# EAGLE design RP2040-M2-B-M-key (EAGLE 9.6.2)
Assembly variants: Lite
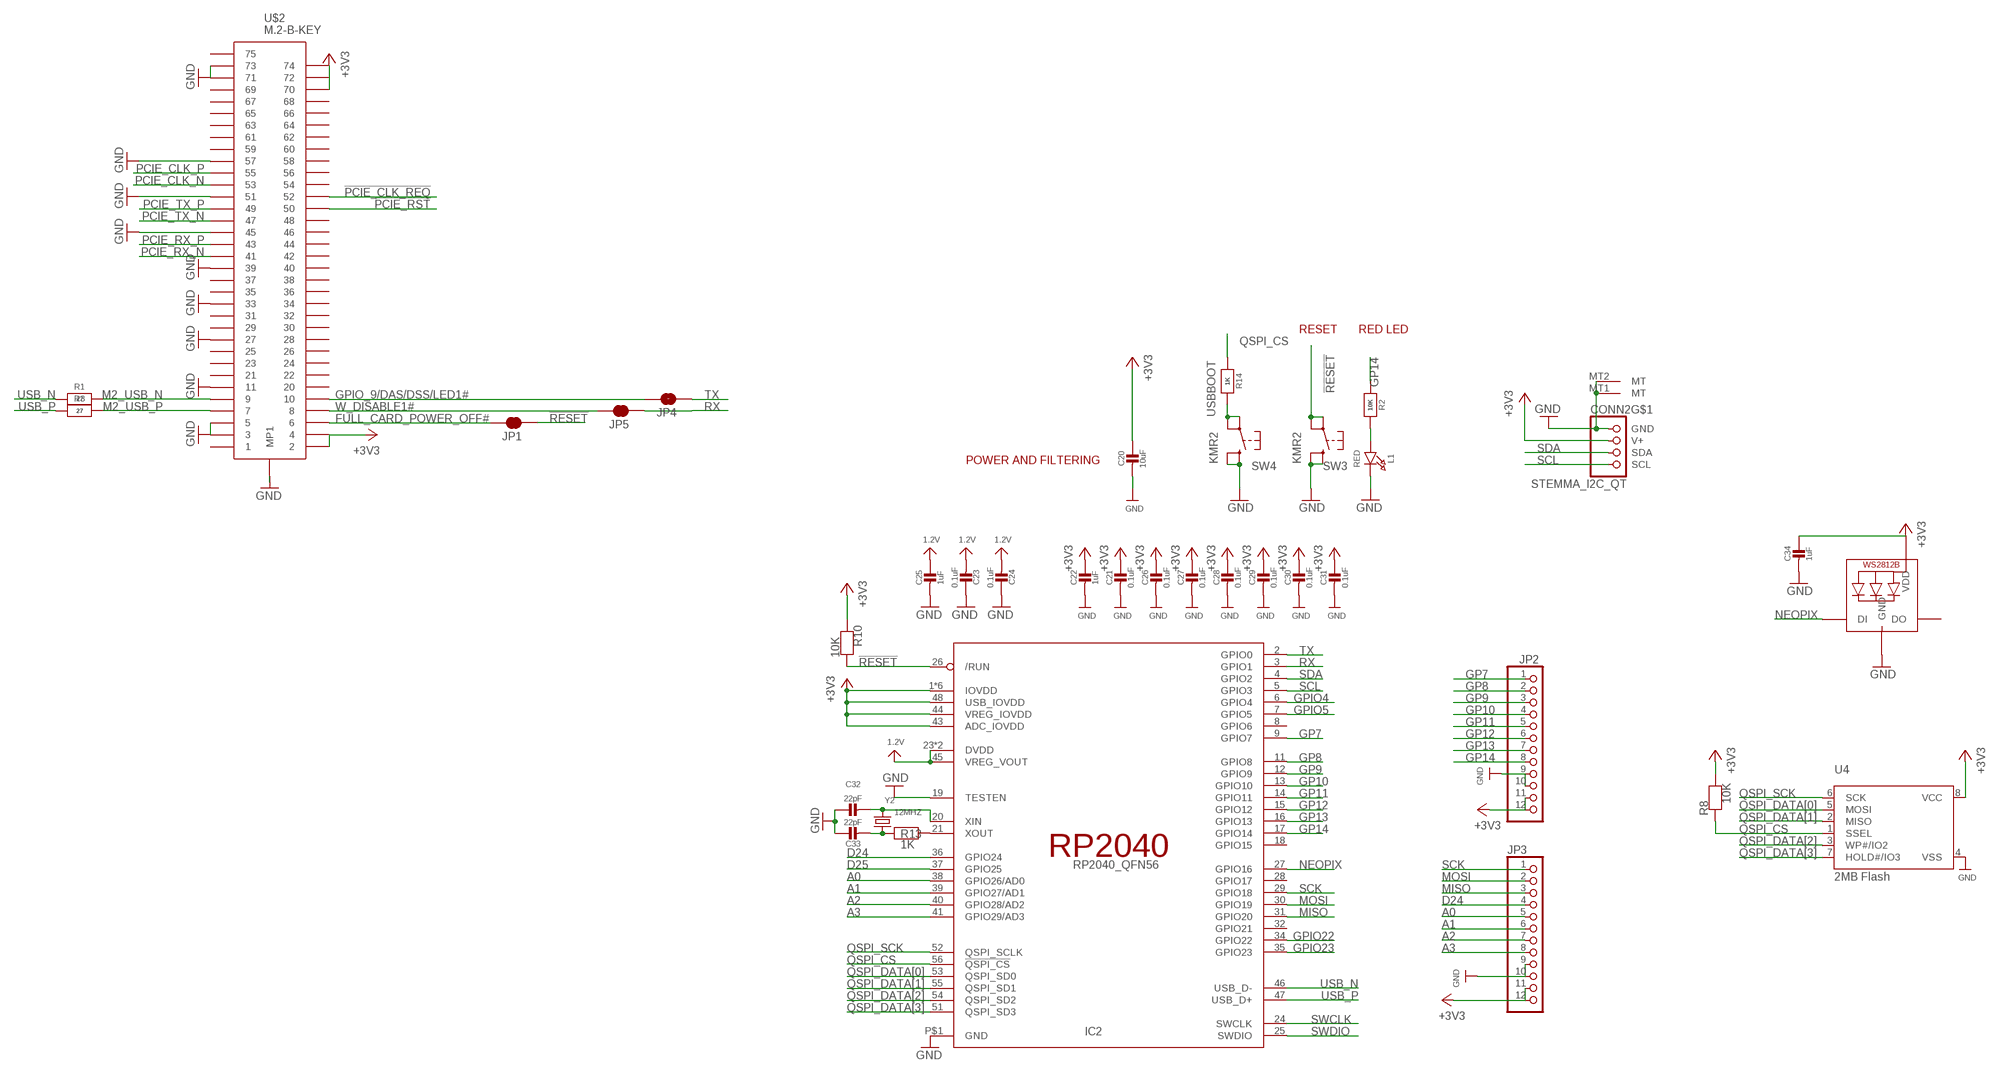
[diagram p0: schematic, sheet 1]

## Parts
C20  10uF  CAP_CERAMIC0805-NOOUTLINE  [0805-NO]
C21  0.1uF  CAP_CERAMIC_0402MP  [_0402MP]
C22  1uF  CAP_CERAMIC_0402MP  [_0402MP]
C23  0.1uF  CAP_CERAMIC_0402MP  [_0402MP]
C24  0.1uF  CAP_CERAMIC_0402MP  [_0402MP]
C25  1uF  CAP_CERAMIC_0402MP  [_0402MP]
C26  0.1uF  CAP_CERAMIC_0402MP  [_0402MP]
C27  0.1uF  CAP_CERAMIC_0402MP  [_0402MP]
C28  0.1uF  CAP_CERAMIC_0402MP  [_0402MP]
C29  0.1uF  CAP_CERAMIC_0402MP  [_0402MP]
C30  0.1uF  CAP_CERAMIC_0402MP  [_0402MP]
C31  0.1uF  CAP_CERAMIC_0402MP  [_0402MP]
C32  22pF  CAP_CERAMIC_0402MP  [_0402MP]
C33  22pF  CAP_CERAMIC_0402MP  [_0402MP]
C34  1uF  CAP_CERAMIC_0402MP  [_0402MP]
CONN2  STEMMA_I2C_QT  [JST_SH4]
IC2  RP2040_QFN56  [QFN56_7MM_REDUCEDEPAD]
JP1  JUMPER-SMT_2_NC_TRACE_NO-SILK  [SMT-JUMPER_2_NC_TRACE_NO-SILK]
JP2  HEADER-1X12  [1X12_ROUND]
JP3  HEADER-1X12  [1X12_ROUND]
JP4  JUMPER-SMT_2_NC_TRACE_NO-SILK  [SMT-JUMPER_2_NC_TRACE_NO-SILK]
JP5  JUMPER-SMT_2_NC_TRACE_NO-SILK  [SMT-JUMPER_2_NC_TRACE_NO-SILK]
L1  RED  LED0603_NOOUTLINE  [CHIPLED_0603_NOOUTLINE]
LED2  WS2812B3535  [LED3535]
R1  27  RESISTOR_0402MP  [_0402MP]
R2  10K  RESISTOR_0402MP  [_0402MP]
R3  27  RESISTOR_0402MP  [_0402MP]
R8  10K  RESISTOR_0402MP  [_0402MP]
R10  10K  RESISTOR_0402MP  [_0402MP]
R13  1K  RESISTOR_0402MP  [_0402MP]
R14  1K  RESISTOR_0402MP  [_0402MP]
SW3  KMR2  SWITCH_TACT_SMT4.6X2.8  [BTN_KMR2_4.6X2.8]
SW4  KMR2  SWITCH_TACT_SMT4.6X2.8  [BTN_KMR2_4.6X2.8]
U4  2MB Flash  SPIFLASH_8PIN208MIL  [SOIC8_208MIL]
U$2  M.2-B-KEY  [M.2-B-KEY]
Y2  12MHZ  CRYSTALTHIN  [CRYSTAL_3.2X2.5]

## Nets
1.2V: C23.2 C24.2 C25.1 IC2.23(DVDD) IC2.45(VREG_VOUT) IC2.50(DVDD)
!PCIE_CLK_REQ: U$2.P$52
!PCIE_RST: U$2.P$50
!RESET: IC2.26(/RUN) JP1.2 R10.2 SW3.A'(P1) SW3.A(P)
+3V3: C20.1 C21.1 C22.1 C26.1 C27.1 C28.1 C29.1 C30.1 C31.1 C34.1 CONN2.2(V+) IC2.1(IOVDD) IC2.10(IOVDD) IC2.22(IOVDD) IC2.33(IOVDD) IC2.42(IOVDD) IC2.43(ADC_IOVDD) IC2.44(VREG_IOVDD) IC2.48(USB_IOVDD) IC2.49(IOVDD) JP2.11 JP2.12 JP3.11 JP3.12 LED2.2(VDD) R8.2 R10.1 U4.8(VCC) U$2.P$2 U$2.P$4 U$2.P$70 U$2.P$72 U$2.P$74
A0: IC2.38(GPIO26/AD0) JP3.5
A1: IC2.39(GPIO27/AD1) JP3.6
A2: IC2.40(GPIO28/AD2) JP3.7
A3: IC2.41(GPIO29/AD3) JP3.8
D24: IC2.36(GPIO24) JP3.4
D25: IC2.37(GPIO25)
FULL_CARD_POWER_OFF#: JP1.1 U$2.P$6
GND: C20.2 C21.2 C22.2 C23.1 C24.1 C25.2 C26.2 C27.2 C28.2 C29.2 C30.2 C31.2 C32.1 C33.1 C34.2 CONN2.1(GND) CONN2.MT1(MT) CONN2.MT2(MT) IC2.19(TESTEN) IC2.P$1(GND) JP2.9 JP2.10 JP3.9 JP3.10 L1.C LED2.4(GND) SW3.B'(S1) SW3.B(S) SW4.B'(S1) SW4.B(S) U4.4(VSS) U$2.MOUNTING-HOLE(MP1) U$2.P$3 U$2.P$5 U$2.P$11 U$2.P$27 U$2.P$33 U$2.P$39 U$2.P$45 U$2.P$51 U$2.P$57 U$2.P$71 U$2.P$73
GP7: IC2.9(GPIO7) JP2.1
GP8: IC2.11(GPIO8) JP2.2
GP9: IC2.12(GPIO9) JP2.3
GP10: IC2.13(GPIO10) JP2.4
GP11: IC2.14(GPIO11) JP2.5
GP12: IC2.15(GPIO12) JP2.6
GP13: IC2.16(GPIO13) JP2.7
GP14: IC2.17(GPIO14) JP2.8 R2.1
GPIO4: IC2.6(GPIO4)
GPIO5: IC2.7(GPIO5)
GPIO22: IC2.34(GPIO22)
GPIO23: IC2.35(GPIO23)
GPIO_9/DAS/DSS/LED1#: JP4.1 U$2.P$10
M2_USB_N: R1.2 U$2.P$9
M2_USB_P: R3.2 U$2.P$7
MISO: IC2.31(GPIO20) JP3.3
MOSI: IC2.30(GPIO19) JP3.2
N$1: L1.A R2.2
N$2: IC2.21(XOUT) R13.2
N$3: C32.2 IC2.20(XIN) Y2.2
N$4: C33.2 R13.1 Y2.1
NEOPIX: IC2.27(GPIO16) LED2.1(DI)
PCIE_CLK_N: U$2.P$53
PCIE_CLK_P: U$2.P$55
PCIE_RX_N: U$2.P$41
PCIE_RX_P: U$2.P$43
PCIE_TX_N: U$2.P$47
PCIE_TX_P: U$2.P$49
QSPI_CS: IC2.56(!QSPI_CS) R8.1 R14.1 U4.1(SSEL)
QSPI_DATA[0]: IC2.53(QSPI_SD0) U4.5(MOSI)
QSPI_DATA[1]: IC2.55(QSPI_SD1) U4.2(MISO)
QSPI_DATA[2]: IC2.54(QSPI_SD2) U4.3(WP#/IO2)
QSPI_DATA[3]: IC2.51(QSPI_SD3) U4.7(HOLD#/IO3)
QSPI_SCK: IC2.52(QSPI_SCLK) U4.6(SCK)
RX: IC2.3(GPIO1) JP5.2
SCK: IC2.29(GPIO18) JP3.1
SCL: CONN2.4(SCL) IC2.5(GPIO3)
SDA: CONN2.3(SDA) IC2.4(GPIO2)
SWCLK: IC2.24(SWCLK)
SWDIO: IC2.25(SWDIO)
TX: IC2.2(GPIO0) JP4.2
USB_N: IC2.46(USB_D-) R1.1
USB_P: IC2.47(USB_D+) R3.1
USBBOOT: R14.2 SW4.A'(P1) SW4.A(P)
W_DISABLE1#: JP5.1 U$2.P$8
Unconnected: IC2.8(GPIO6) IC2.18(GPIO15) IC2.28(GPIO17) IC2.32(GPIO21) LED2.3(DO) U$2.P$1 U$2.P$20 U$2.P$21 U$2.P$22 U$2.P$23 U$2.P$24 U$2.P$25 U$2.P$26 U$2.P$28 U$2.P$29 U$2.P$30 U$2.P$31 U$2.P$32 U$2.P$34 U$2.P$35 U$2.P$36 U$2.P$37 U$2.P$38 U$2.P$40 U$2.P$42 U$2.P$44 U$2.P$46 U$2.P$48 U$2.P$54 U$2.P$56 U$2.P$58 U$2.P$59 U$2.P$60 U$2.P$61 U$2.P$62 U$2.P$63 U$2.P$64 U$2.P$65 U$2.P$66 U$2.P$67 U$2.P$68 U$2.P$69 U$2.P$75

## Notes on the sheet
- RESET | RED LED
- POWER AND FILTERING

## Library data of the parts
C20-C34 = microbuilder:CAP_CERAMIC: Ceramic Capacitors
CONN2 = microbuilder:STEMMA_I2C
IC2 = Custom-Parts:RP2040
JP1 JP4 JP5 = SparkFun-Jumpers:JUMPER-SMT_2_NC_TRACE: Normally closed trace jumper This jumper has a trace between two pads so it's normally closed (NC). Use a razor knife to open the connection. For best results follow the IPC guidelines for cutting traces: Cutout at least 0.063 mm (0.005 in). Remove all loose material to clean up the cut area. Seal the cut with an approved epoxy. Reapply solder to reclose the connection.
JP2 JP3 = microbuilder:HEADER-1X12
L1 = microbuilder:LED: LED 0603 - 0603 Surface Mount Package 2mA: Green LED - Low Power (3.9mcd, 2ma, 1.7Vf) - Digikey: 475-2709-2-ND Orange LED - Low Power (9.8mcd, 2ma, 1.8Vf) - Digikey: 475-1194-2-ND Red LED - Low Power (5mcd, 2ma, 1.8Vf) - Digikey: 475-1195-2-ND Yellow LED - Low Power (7mcd, 2ma, 1.8Vf) - Digikey: 475-1196-2-ND 5mA: Blue LED - Low Power (17mcd, 5ma, 2.9Vf) - Digikey: LNJ937W8CRACT-ND 0805 - 0805 Surface Mount Package 2mA: Red LED (8.8mcd, 2mA, 1.8Vf, Clear) - Low Power [Digikey: 475-2510-1-ND] Green LED (5mcd, 2mA, 1.8Vf, Clear) - Low Power [Digikey: 475-2730-1-ND] Yellow LED (11.3mcd, 2mA, 1.8Vf, Clear) - Low Power [Digikey: 475-2555-1-ND] 20mA: Red LED (104mcd, 20mA, Diffused) - LS R976 [Digikey: 475-1278-6-ND] Red LED (12mcd, 20mA, 2.0Vf, Clear) - APT2012EC [Digikey: 754-1128-1-ND] Green LED (15mcd, 20mA, 2.2Vf, Clear) - APT2012GC [Digikey: 754-1131-1-ND] Orange LED (160mcd, 20mA, 2.1Vf, Clear) - APT2012SECK [Digikey: 754-1130-1-ND] 1206 - 1206 Surface Mount Package Green LED (26mcd, 20mA, Diffused) - LG N971 [Digikey: 475-1407-6-ND] Red LED (15mcd, 20mA, Diffused) - LH N974 [Digikey: 475-1416-6-ND] Cree - Cree High-Power Surface Mount LEDs XPEBWT-L1-0000-00D50 - White 111lm 350mA 2.9Vf 6200K 110° XTEAWT-00-0000-00000LEE3 - White 114lm 350mA 2.85Vf 5000K 115° Everlight - Everlight 45-21 Series Surface Mount LEDs 45-21/QK2C-B2832AC2CB2/2T - Warm White 2000mcd 20mA 3.25Vf 3050K 120° 45-21/LK2C-B38452C4CB2/2T - Nuetral White 2000mcd 20mA 3.25Vf 4150K 120° 45-21/LK2C-B50634C6CB2/2T - Cold White 2200mcd 20mA 3.25Vf 5650K 120° PLCC2 Reverse Mount LS T77K-J1L2-1-0-2-R18-Z - Red 11.25mcd 2mA 1.8Vf 630nm 120° LO T77K-L1M2-24-Z - Orange 19.6mcd 2mA 1.8Vf 606nm 120° LY T77K-K2M1-26-Z - Yellow 15.7mcd 2mA 1.8Vf 587nm 120°
LED2 = adafruit:WS2812B
R1-R3 R8 R10 R13 R14 = microbuilder:RESISTOR: Resistors 0402 - 0402 Surface Mount Package 22 Ohm 1% 1/16W [Digikey: 311-22.0LRTR-ND] 33 Ohm 5% 1/16W 1.0K 5% 1/16W 1.5K 5% 1/16W 2.0K 1% 1/16W 10.0K 1% 1/16W [Digikey: 311-10.0KLRTR-ND] 10.0K 5% 1/16W [Digikey: RMCF0402JT10K0TR-ND] 12.1K 1% 1/16W [Digikey: 311-22.0LRTR-ND] 100.0K 5% 1/16W 0603 - 0603 Surface Mount Package 0 Ohm 1/10 Watt 1% Resistor 15 Ohm 1/10 Watt 1% Resistor 33 Ohm 1/10 Watt 1% Resistor 49.9 Ohm 1/10 Watt 1% Resistor 100 Ohm 1/10 Watt 1% Resistor 150 Ohm 1/10 Watt 1% Resistor 240 Ohm 1/10 Watt 1% Resistor 390 Ohm 1/10 Watt 1% Resistor 560 Ohm 1/10 Watt 1% Resistor 680 Ohm 1/10 Watt 1% Resistor 750 Ohm 1/10 Watt 1% Resistor 1.0K Ohm 1/10 Watt 1% Resistor 1.5K Ohm 1/10 Watt 1% Resistor 2.0K Ohm 1/10 Watt 1% Resistor 2.2K Ohm 1/10 Watt 1% Resistor 3.3K Ohm 1/10 Watt 1% Resistor 4.7K Ohm 1/10 Watt 1% Resistor 10.0K Ohm 1/10 Watt 1% Resistor 12.0K Ohm 1/10 Watt 1% Resistor 12.1K Ohm 1/10 Watt 1% Resistor 20.0K Ohm 1/10 Watt 1% Resistor 33.0K Ohm 1/10 Watt 1% Resistor 100.0K Ohm 1/10 Watt 1% Resistor 0805 - 0805 Surface Mount Package 0 Ohm 1/8 Watt 1% Resistor 33 Ohm 1/8 Watt 1% Resistor 100 Ohm 1/8 Watt 1% Resistor 150 Ohm 1/8 Watt 1% Resistor 200 Ohm 1/8 Watt 1% Resistor 240 Ohm 1/8 Watt 1% Resistor 330 Ohm 1/8 Watt 1% Resistor 390 Ohm 1/8 Watt 1% Resistor 470 Ohm 1/8 Watt 1% Resistor 1.0K Ohm 1/8 Watt 1% Resistor 1.5K Ohm 1/8 Watt 1% Resistor 2.0K Ohm 1/8 Watt 1% Resistor 4.7K Ohm 1/8 Watt 1% Resistor 5.1K Ohm 1/8 Watt 1% Resistor 5.6K Ohm 1/8 Watt 1% Resistor 10.0K Ohm 1/8 Watt 1% Resistor 22.0K Ohm 1/8 Watt 1% Resistor 33.0K Ohm 1/8 Watt 1% Resistor 100K Ohm 1/8 Watt 1% Resistor 1206 - 1206 Surface Mount Package 2012 - 2010 Surface Mount Package 0.11 Ohm 1/2 Watt 1% Resistor - Digikey: RHM.11UCT-ND
SW3 SW4 = microbuilder:SWITCH_TACT_SMT: SMT Tact Switches 6x6mm - Digikey: P12940SCT-ND KMR2 (4.6x2.8mm) - Digikey: 401-1426-1-ND EVQ-PQHB55 - Light Touch, 160GF (4.5x4.5mm) - Digikey: P8090SCT-ND KMT0 - KMT021 NGJ LHS (etc.) IP68/Waterproof - Digikey: CKN10289CT-ND
U4 = microbuilder:SPIFLASH_8PIN: SOIC8 SPI Flash Be careful with the size since SOIC8 flash comes in several 'widths' SOIC8 150 mil M25P16 - 16Mbit (2Mbit x 8) Serial Flash (75MHz SPI Bus), Supply: 2.7-3.6V Digikey: SOIC8 - M25P16-VMN6P-ND SOIC8 208 mil W25Q16BVSSIG - 16Mbit (2Mbit x 8) Serial Flash (104MHz SPI Bus), Supply: 2.7-3.6V Digikey: SOIC8 - W25Q16BVSSIG-ND
U$2 = Custom-Parts:M.2-B-KEY
Y2 = microbuilder:CRYSTAL: Crystals HC49UP - Surface Mount Crystal 4.0MHz 18pF +/-30ppm Surface Mount Crystal [Digikey: 535-9857-1-ND] 12.0 MHz Surface Mount Crystal [Digikey: 535-9869-6-ND] 25.0 MHz Surface Mount Crystal [Digikey: 535-9078-1-ND] 2.5 x 2.0mm - MEMs SMT Crystal 16.0 MHz 10pF 20ppm 2.5 x 2.0mm Crystal [Digikey -40-85°C: 535-10923-1-ND] 3.2 x 2.5mm - MEMs SMT Crystal 12.0 MHz 8pF 15ppm 3.2 x 2.5mm Crystal [Digikey: -10-70°C: 644-1047-1-ND -40-125°C: 644-1128-1-ND] 16.0 MHz 8pF 15ppm 3.2 x 2.5mm Crystal [Digikey: -10-70°C: 644-1049-1-ND -40-125°C: 644-1129-2-ND] 16.0 MHz 10pF 10ppm 3.2 x 2.5mm Crystal [Digikey: 644-1100-1-ND] 27.12 MHz 18pF 30ppm 3.2 x 2.5mm Crystal [Digikey: 887-1424-1-ND] 27.12MHz 10pF 10ppm 3.2 x 2.5mm Crystal [Digikey: 887-1329-1-ND] 4.9 x 1.8mm - MEMs SMT Crystal 32.768 KHz 12.5pF 20ppm 4.9 x 1.8mm Crystal [Digikey: SE2415CT-ND] 8.0 x 3.8mm - Surface Mount Crystal 32.768kHz 12.5pF 20ppm -40°C-85°C [Digikey: 535-9166-2-ND] Cylinder 32.768KHz Cylinder Crystal (2x6mm body) [Ex. Digikey: 300-8341-2-ND]

## Board
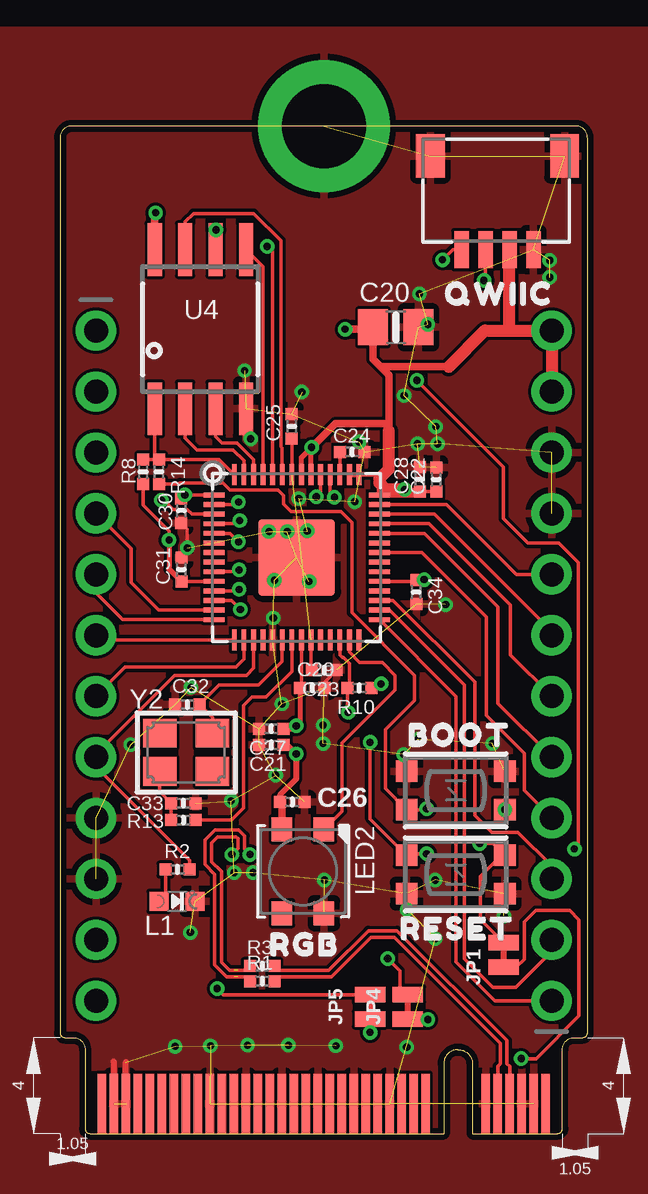
[diagram p1: board, top side]
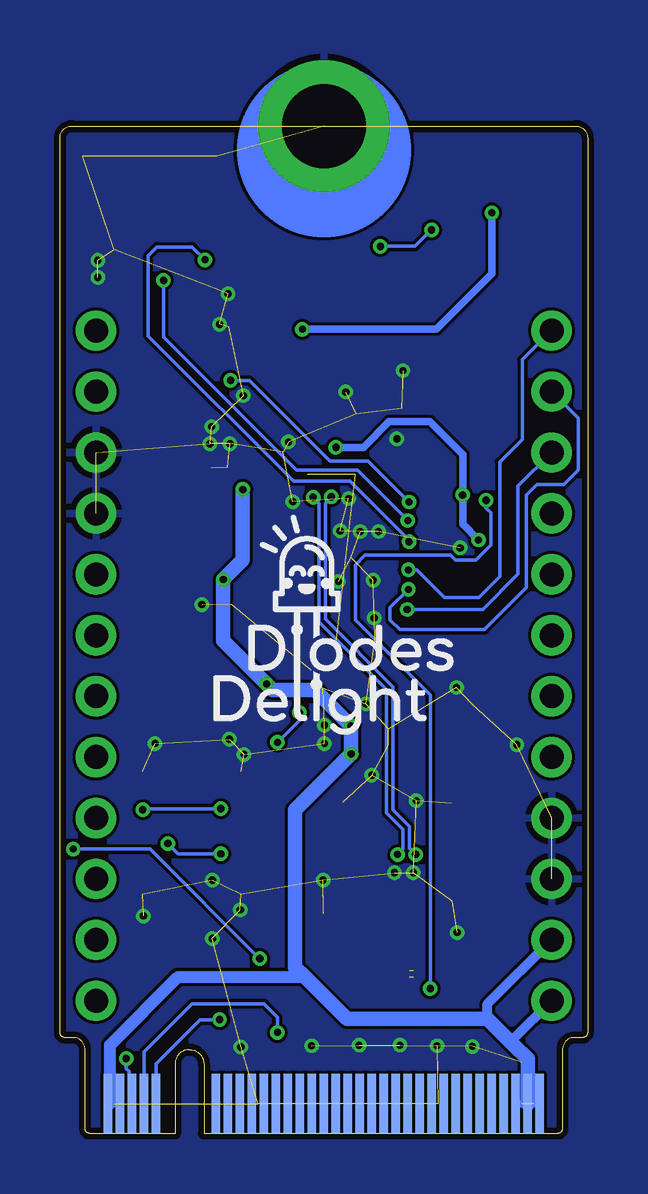
[diagram p2: board, bottom side, seen from below]

Size 22 x 42 mm. Coordinates in mm from the lower left corner, seen from the top.
Copper layers (1*16): Top 0.035mm / dielectric 0.8mm / Bottom 0.035mm
Design rules "jlc-2layer": minimum track width 6mil, minimum drill 0.3mm, track to track 5mil, track to pad 5mil, pad to pad 5mil, via to via 5mil, smd to smd 0mil, copper to edge 0.25mm, drill to drill 10mil, minimum pad ring 10mil, minimum via ring 0.15mm, stop-mask expansion 2mil, vias tented up to drill 100mil, thermal gap 10mil

### Footprints (pad centres in the part's own frame; a part is rotated, then mirrored left to right if it is on the bottom)
0805-NO = smd 1.24 x 1.5: 1 -0.95,0; 2 0.95,0
_0402MP = smd 0.5 x 0.5: 1 -0.508,0; 2 0.508,0
JST_SH4 = smd 0.6 x 1.55: 1 -1.5,2.514; 2 -0.5,2.514; 3 0.5,2.514; 4 1.5,2.514 | smd 1.2 x 1.8: MT1 -2.8,-1.386; MT2 2.8,-1.386
QFN56_7MM_REDUCEDEPAD = smd 0.875 x 0.2: 1 -3.45,2.6; 2 -3.45,2.2; 3 -3.45,1.8; 4 -3.45,1.4; 5 -3.45,1; 6 -3.45,0.6; 7 -3.45,0.2; 8 -3.45,-0.2; 9 -3.45,-0.6; 10 -3.45,-1; 11 -3.45,-1.4; 12 -3.45,-1.8; 13 -3.45,-2.2; 14 -3.45,-2.6; 29 3.45,-2.6; 30 3.45,-2.2; 31 3.45,-1.8; 32 3.45,-1.4; 33 3.45,-1; 34 3.45,-0.6; 35 3.45,-0.2; 36 3.45,0.2; 37 3.45,0.6; 38 3.45,1; 39 3.45,1.4; 40 3.45,1.8; 41 3.45,2.2; 42 3.45,2.6 | smd 0.2 x 0.875: 15 -2.6,-3.45; 16 -2.2,-3.45; 17 -1.8,-3.45; 18 -1.4,-3.45; 19 -1,-3.45; 20 -0.6,-3.45; 21 -0.2,-3.45; 22 0.2,-3.45; 23 0.6,-3.45; 24 1,-3.45; 25 1.4,-3.45; 26 1.8,-3.45; 27 2.2,-3.45; 28 2.6,-3.45; 43 2.6,3.45; 44 2.2,3.45; 45 1.8,3.45; 46 1.4,3.45; 47 1,3.45; 48 0.6,3.45; 49 0.2,3.45; 50 -0.2,3.45; 51 -0.6,3.45; 52 -1,3.45; 53 -1.4,3.45; 54 -1.8,3.45; 55 -2.2,3.45; 56 -2.6,3.45 | smd 3.2 x 3.2: P$1 0,0
SMT-JUMPER_2_NC_TRACE_NO-SILK = smd 0.635 x 1.27: 1 -0.508,0; 2 0.508,0
1X12_ROUND = drill 1 pad 1.676: 1 -13.97,0; 2 -11.43,0; 3 -8.89,0; 4 -6.35,0; 5 -3.81,0; 6 -1.27,0; 7 1.27,0; 8 3.81,0; 9 6.35,0; 10 8.89,0; 11 11.43,0; 12 13.97,0
CHIPLED_0603_NOOUTLINE = smd 0.8 x 0.8: A 0,-0.75; C 0,0.75
LED3535 = smd 1 x 0.85: 1 -1.75,0.875; 2 -1.75,-0.875; 3 1.75,-0.875; 4 1.75,0.875
BTN_KMR2_4.6X2.8 = smd 0.9 x 0.9: A 2.05,0.8; A' -2.05,0.8; B 2.05,-0.8; B' -2.05,-0.8
SOIC8_208MIL = smd 0.6 x 2.2: 1 -1.905,-3.315; 2 -0.635,-3.315; 3 0.635,-3.315; 4 1.905,-3.315; 5 1.905,3.315; 6 0.635,3.315; 7 -0.635,3.315; 8 -1.905,3.315
M.2-B-KEY = drill 3.5 pad 5.5: MOUNTING-HOLE 0,42 | smd 0.35 x 2.5: P$1 9.25,1.25; P$3 8.75,1.25; P$5 8.25,1.25; P$7 7.75,1.25; P$9 7.25,1.25; P$11 6.75,1.25; P$21 4.25,1.25; P$23 3.75,1.25; P$25 3.25,1.25; P$27 2.75,1.25; P$29 2.25,1.25; P$31 1.75,1.25; P$33 1.25,1.25; P$35 0.75,1.25; P$37 0.25,1.25; P$39 -0.25,1.25; P$41 -0.75,1.25; P$43 -1.25,1.25; P$45 -1.75,1.25; P$47 -2.25,1.25; P$49 -2.75,1.25; P$51 -3.25,1.25; P$53 -3.75,1.25; P$55 -4.25,1.25; P$57 -4.75,1.25; P$59 -5.25,1.25; P$61 -5.75,1.25; P$63 -6.25,1.25; P$65 -6.75,1.25; P$67 -7.25,1.25; P$69 -7.75,1.25; P$71 -8.25,1.25; P$73 -8.75,1.25; P$75 -9.25,1.25 | smd 0.35 x 2.5 bottom: P$2 9,1.25; P$4 8.5,1.25; P$6 8,1.25; P$8 7.5,1.25; P$10 7,1.25; P$20 4.5,1.25; P$22 4,1.25; P$24 3.5,1.25; P$26 3,1.25; P$28 2.5,1.25; P$30 2,1.25; P$32 1.5,1.25; P$34 1,1.25; P$36 0.5,1.25; P$38 0,1.25; P$40 -0.5,1.25; P$42 -1,1.25; P$44 -1.5,1.25; P$46 -2,1.25; P$48 -2.5,1.25; P$50 -3,1.25; P$52 -3.5,1.25; P$54 -4,1.25; P$56 -4.5,1.25; P$58 -5,1.25; P$60 -5.5,1.25; P$62 -6,1.25; P$64 -6.5,1.25; P$66 -7,1.25; P$68 -7.5,1.25; P$70 -8,1.25; P$72 -8.5,1.25; P$74 -9,1.25
CRYSTAL_3.2X2.5 = smd 1.4 x 1.2: 1 -1.1,-0.8; 2 1.1,0.8; GND1 -1.1,0.8; GND2 1.1,-0.8

### Placement (x,y rotation side)
C20  14,33.61 0 top
C21  8.82,16.2 180 top
C22  15.69,27.26 90 top
C23  11.03,19.31 180 top
C24  12.19,28.41 180 top
C25  9.67,29.48 90 top
C26  9.69,13.82 0 top
C27  8.81,16.87 180 top
C28  15,27.28 90 top
C29  10.52,18.58 0 top
C30  5.06,25.96 270 top
C31  5.07,23.51 90 top
C32  5.31,17.88 0 top
C33  5.15,13.77 180 top
C34  14.86,22.57 270 top
CONN2  18.25,39.36 180 top
IC2  9.87,24.02 0 top
JP1  18.5,7.45 90 top
JP2  1.5,19.5 270 top
JP3  20.5,19.5 90 top
JP4  14.51,5.28 90 top
JP5  12.93,5.28 90 top
L1  4.88,9.68 270 top
LED2  10.13,10.93 270 top
R1  8.43,6.35 0 top
R2  4.9,11.01 180 top
R3  8.43,6.99 0 top
R8  3.47,27.58 270 top
R10  12.49,18.57 180 top
R13  5.15,13.07 0 top
R14  4.13,27.58 270 top
SW3  16.5,10.8 0 top
SW4  16.5,14.3 180 top
U4  5.86,33.52 0 top
U$2  11,0 0 top
U$4  [BOOT0]  13.82,16.61 0 top
U$5  [RESET0]  13.49,8.53 0 top
U$6  [QWIIC0]  15.34,35 0 top
U$7  [RGB0]  8.05,7.87 0 top
U$8  [DIODES-DELIGHT-LOGO-10X10-TPLACE]  15.6,16.64 0 bottom
Y2  5.26,15.89 0 top

### Tracks (layer width: path | path; a pad name or v marks a point on that pad's centre or on a via)
1.2V  (2 unrouted)
  Top 0.152: C24.2 IC2.45 | C25.1 9.67,28.91 IC2.50 | C23.2 10.47,19.36 IC2.23
!RESET  (via drill 0.3)
  Top 0.152: IC2.26 11.67,19.95 11.79,19.84 11.81,19.84 12.07,19.58 12.07,18.66 R10.2 11.98,17.59 v12.02,17.55 | JP1.2 17.53,8.93 17.53,10.72 18.41,11.6 SW3.A 18.06,12.09 v17.5,12.09 | v12.93,16.31 12.93,13.12 SW3.A' 14.51,11.66 v15.29,11.66
  Bottom 0.152: v12.93,16.31 12.02,17.22 v12.02,17.55 | v15.29,11.66 17.07,11.66 v17.5,12.09
+3V3  (via drill 0.3)
  Top 0.152: 14.85,26.62 C28.1 15.67,26.77 C22.1 | v5.21,26.62 IC2.1 | C31.1 6.41,23 IC2.10 | IC2.22 10.07,19.65 10.07,18.64 C29.1 | IC2.33 14.61,23.02 C34.1 15.09,23.18 v15.19,23.09 | R8.2 3.47,26.2 4.55,25.12 v4.55,24.74
  Top 0.203: 14.85,26.62 IC2.42 13.32,27.13 13.32,27.3 13.15,27.47 IC2.43 IC2.44 | C21.1 9.48,16.2 v9.86,15.82 | C27.1 9.73,16.87 v9.86,16.99 10.01,17.15 C29.1 | R10.1 13.21,18.57 v13.39,18.75 | C31.1 4.55,23.52 v4.55,24.74 | C30.1 v5.21,26.62 | IC2.48 10.47,28.58 | 10.47,28.58 v10.49,28.6 | IC2.49 10.07,28.18 10.47,28.58
  Top 0.254: C26.1 9.18,14.11 9.86,14.78 v9.86,15.82
  Top 0.305: C28.1 14.46,26.77 v14.38,26.85 | 12.73,33.92 C20.1 | C20.1 13.19,33.47 | C26.1 9.26,13.74 LED2.2 | 13.72,27.69 13.72,29.29 13.72,29.59 | 13.72,29.59 13.72,31.62 13.39,31.95 13.36,31.98 | v10.49,28.6 11.48,29.59 13.72,29.59 | 13.36,31.98 13.05,32.29 13.05,33.35 | 13.05,33.35 C20.1 | 13.36,31.98 16.23,31.98 | 16.21,31.95 16.23,31.95 | JP3.12 18.72,33.47 17.72,33.47 | U4.8 3.95,38.34 v3.99,38.38 | v11.89,33.53 12.87,33.53 13.05,33.35
  Top 0.508: JP3.11 JP3.12 17.72,33.47 16.23,31.98 16.21,31.95 | 13.32,27.3 13.72,27.69 13.72,29.29 | 18.72,33.47 18.75,33.49 CONN2.2 | v14.38,26.85 13.6,26.85 13.32,27.13
  Bottom 0.305: U$2.P$74 U$2.P$72 U$2.P$70 | U$2.P$4 19.79,1.25 19.91,1.25 U$2.P$2 | v3.99,38.38 3.99,35.84 6.3,33.53 v11.89,33.53 | v10.49,28.6 9.35,28.6 8.28,29.67 6.58,29.67 5.21,28.29 v5.21,26.62 5.21,25.4 v4.55,24.74
  Bottom 0.406: JP2.12 3.09,3.94 3.09,3.7 | 4.17,4.78 4.17,5.4 JP2.11
  Bottom 0.508: 19.91,1.25 19.91,3.68 17.07,6.53 11.79,6.53
  Bottom 0.61: U$2.P$72 2.5,3.11 3.09,3.7 4.17,4.78 10.04,4.78 11.79,6.53 12.19,6.93 12.19,13.49 v9.86,15.82 v9.86,16.99 11.36,18.49 13.13,18.49 v13.39,18.75 15.19,20.55 v15.19,23.09 14.38,23.9 v14.38,26.85 14.38,26.87
A0
  Top 0.152: IC2.38 15.19,25.02 18.26,21.95 18.26,17.93 JP3.5
A1
  Top 0.152: JP3.6 18.77,19.96 18.77,22.02 15.38,25.42 IC2.39
A2
  Top 0.152: IC2.40 15.61,25.82 20.5,20.93 JP3.7
A3
  Top 0.152: JP3.8 19.03,23.31 16.12,26.22 IC2.41
D24
  Top 0.152: JP3.4 19.36,14.29 19.36,15.85 17.78,17.42 17.78,21.54 15.1,24.22 IC2.36
FULL_CARD_POWER_OFF#  (via drill 0.3)
  Top 0.152: JP1.1 19.03,6.94 19.36,7.26 19.36,8.81 19.84,9.3 21.26,9.3 21.64,8.91 21.64,4.9 19.87,3.12 v19.23,3.12
  Bottom 0.152: v19.23,3.12 19.23,2.7 19.12,2.58 19.12,1.37 U$2.P$6
GND  (via drill 0.3)  (84 unrouted)
  Top 0.152: C30.2 5.31,25.2 v5.31,24.41 5.31,24.26 C31.2 | C29.2 11.03,18.8 C23.1
  Top 0.254: U$2.P$71 2.74,2.97 | U$2.P$73 2.25,2.98 2.24,3
  Top 0.305: U4.4 7.76,29.15 v7.95,28.96
  other vias: 7.7,31.8 8.71,25.1 8.94,23.06 10.39,23.01 10.31,25.12 8.89,21.49 15.34,33.73 20.42,36.4 20.42,35.69 10.97,17.02 10.97,16.26 14.33,15.8 14.48,9.32 12.3,26.34 9.96,26.47 4.8,3.63 6.28,3.66 7.83,3.68 9.53,3.68 11.51,3.66 14.45,3.61 5.44,8.38 11.03,10.57 14.94,16.43 18.04,16.26 15.65,10.57 18.52,9.07 15.65,8.13 2.95,16.21 5.46,18.59 9.25,17.91 8.99,14.94 7.14,13.87 9.48,25.1 10.09,30.91 14.99,35 12.47,28.83 14.35,30.76 15.67,29.46 14.91,28.75 15.75,28.75 16.08,22.05 7.27,10.87 8.05,10.87
  pour Top: -3,46 25,46 25,-6 -3,-6
  pour Bottom: -5,48 28,48 28,-8 -5,-8
GP7  (via drill 0.3)
  Top 0.152: v7.47,23.5 7.39,23.42 IC2.9
  Bottom 0.152: JP2.1 2.72,32.25 2.72,28.93 3.66,27.99 3.66,23.22 4.52,22.35 5.97,22.35 7.11,23.5 v7.47,23.5
GP8  (via drill 0.3)
  Top 0.152: IC2.11 7.4,22.62 v7.47,22.68
  Bottom 0.152: v7.47,22.68 8.23,21.92 8.23,21.41 7.83,21.01 4.29,21.01 2.54,22.76 2.54,26.62 2.11,27.05 0.99,27.05 0.38,27.66 0.38,29.81 JP2.2
GP9  (via drill 0.3)
  Top 0.152: IC2.12 7.15,22.22 v7.52,21.84
  Bottom 0.152: v7.52,21.84 4.37,21.84 2.9,23.32 2.9,26.99 JP2.3
GP10
  Top 0.152: IC2.13 4.12,21.82 2.97,22.96 2.97,24.38 JP2.4
GP11
  Top 0.152: IC2.14 2.61,21.42 1.5,22.53 JP2.5
GP12
  Top 0.152: IC2.15 1.7,20.57 JP2.6
GP13
  Top 0.152: JP2.7 2.73,19.46 7.34,19.46 7.67,19.78 IC2.16
GP14
  Top 0.152: IC2.17 8.07,19.4 7.77,19.1 4.78,19.1 1.5,15.82 JP2.8 1.5,15.29 5.41,11.38 R2.1
GPIO_9/DAS/DSS/LED1#  (via drill 0.3)
  Top 0.152: v15.34,4.75 14.2,4.75 14.18,4.78 JP4.1
  Bottom 0.152: U$2.P$10 18,2.91 17.29,3.62 16.16,4.75 v15.34,4.75
M2_USB_N
  Top 0.152: R1.2 9.12,6.53 11.32,6.53 12.97,8.18 13.95,8.18 18.36,3.77 18.36,2.92 18.25,2.81 U$2.P$9
M2_USB_P
  Top 0.152: R3.2 9.12,6.81 11.2,6.81 12.85,8.46 14.06,8.46 18.64,3.88 18.64,2.92 18.75,2.81 U$2.P$7
MISO
  Top 0.152: IC2.31 13.89,22.22 17.3,18.82 17.3,13.26 18.01,12.55 19.1,12.55 20.5,11.15 JP3.3
MOSI
  Top 0.152: IC2.30 13.35,21.85 13.71,21.85 16.87,18.69 16.87,7.29 18.06,6.1 19,6.1 20.5,7.59 JP3.2
N$1
  Top 0.152: L1.A 4.4,9.94 R2.2
N$2
  Top 0.152: R13.2 7.16,13.07 7.65,13.56 7.65,17.85 8,18.2 8.6,18.2 9.67,19.27 IC2.21
N$3
  Top 0.152: Y2.2 6.36,17.34 C32.2 6.63,18.69 8.28,18.69 9.27,19.68 IC2.20
N$4
  Top 0.152: Y2.1 4.16,14.25 C33.2 R13.1
NEOPIX
  Top 0.152: LED2.1 11.76,13.44 11.76,16.28 13.97,18.49 13.97,19.1 13.44,19.63 12.5,19.63 12.07,20.06 IC2.27
QSPI_CS
  Top 0.152: R8.1 3.48,28.09 R14.1 | R14.1 3.95,28.27 U4.1 | IC2.56 6.65,28.09 R14.1
QSPI_DATA[0]
  Top 0.152: U4.5 8.47,36.13 IC2.53
QSPI_DATA[1]
  Top 0.152: U4.2 5.22,29 5.72,28.5 7.21,28.5 7.67,28.04 IC2.55
QSPI_DATA[2]
  Top 0.152: IC2.54 8.07,28.1 7.39,28.78 6.76,28.78 6.49,29.05 U4.3
QSPI_DATA[3]
  Top 0.152: IC2.51 9.27,28.58 9.21,28.64 9.21,37.22 8.08,38.35 5.56,38.35 5.22,38.01 U4.7
QSPI_SCK  (via drill 0.3)
  Top 0.152: IC2.52 8.87,36.75 v8.64,36.98 | v6.5,37.67 6.5,36.85 U4.6
  Bottom 0.152: v8.64,36.98 7.19,36.98 v6.5,37.67
RX  (via drill 0.3)
  Top 0.152: 12.37,5.79 JP5.2 12.37,5.79 | 12.37,5.79 6.81,5.79 v6.55,6.04 | v4.23,26.4 4.34,26.4 4.72,26.02 5.3,26.02 5.5,25.82 IC2.3
  Bottom 0.152: v6.55,6.04 6.55,18.29 9.68,21.41 9.68,23.7 9.27,24.11 5.72,24.11 5.52,23.91 4.66,23.91 4.04,24.53 4.04,25.89 4.23,26.08 v4.23,26.4
SCK
  Top 0.152: IC2.29 16.51,18.23 16.51,7.16 18.14,5.53 JP3.1
SCL  (via drill 0.3)
  Top 0.152: IC2.5 7.09,25.02 v7.44,24.66 | v15.95,36.42 16.38,36.85 CONN2.4
  Bottom 0.152: v7.44,24.66 7.44,24.74 9.91,27.2 12.27,27.2 18.32,33.25 18.32,36.6 17.96,36.96 16.49,36.96 v15.95,36.42
SDA  (via drill 0.3)
  Top 0.152: IC2.4 7.36,25.42 v7.5,25.55 | v17.68,35.56 17.75,35.62 CONN2.3
  Bottom 0.152: v7.5,25.55 9.6,27.66 12.14,27.66 17.68,33.2 v17.68,35.56
TX  (via drill 0.3)
  Top 0.152: IC2.2 7.34,26.22 v7.44,26.32 | v14.89,31.39 18.49,27.79 18.49,25.63 19.51,24.61 20.8,24.61 21.62,23.8 21.62,12.03 v21.45,11.86 | v13.67,7.29 14.18,6.78 14.18,5.79 JP4.2
  Bottom 0.152: v7.44,26.32 9.16,28.04 10.75,28.04 14.1,31.39 v14.89,31.39 | v21.45,11.86 18.24,11.86 v13.67,7.29
USB_N  (via drill 0.3)  (1 unrouted)
  Top 0.152: v11.44,26.52 11.27,26.69 IC2.46 | v7.92,11.63 7.7,11.86 7.7,12.41 7.46,12.65 6.46,12.65 6.05,12.23 6.05,11.21 6.45,10.81 6.45,7.02 6.95,6.53 7.75,6.53 R1.1
  Bottom 0.152: v11.44,26.52 11.24,26.32 11.24,26.3 11.2,26.26 11.2,21.32 8.38,18.5 8.38,13.37 7.7,12.69 7.7,11.86 v7.92,11.63
USB_P  (via drill 0.3)  (1 unrouted)
  Top 0.152: v10.69,26.54 10.87,26.73 IC2.47 | v7.17,11.63 7.42,11.88 7.42,12.29 7.34,12.37 6.58,12.37 6.33,12.12 6.33,11.33 6.73,10.92 6.73,7.14 7.06,6.81 7.75,6.81 R3.1
  Bottom 0.152: v10.69,26.54 10.89,26.34 10.89,26.3 10.92,26.26 10.92,21.44 8.1,18.62 8.1,13.49 7.42,12.8 7.42,11.88 v7.17,11.63
USBBOOT  (via drill 0.3)
  Top 0.152: R14.2 4.95,27.07 5,27.12 6.79,27.12 7.09,26.83 9.09,26.83 9.32,26.59 9.32,26.24 9.63,25.93 11.71,25.93 12.17,25.48 12.17,21.72 14.79,19.1 14.79,18.06 13.56,16.84 13.56,14.38 SW4.A 15.25,13.5 v15.29,13.54
  Bottom 0.152: v15.29,13.54 18.51,13.54 SW4.A'
  other vias: 18.55,13.5
W_DISABLE1#  (via drill 0.3)
  Top 0.152: JP5.1 v12.93,4.22
  Bottom 0.152: v12.93,4.22 12.93,4.85 13.49,5.41 16.49,5.41 18.5,3.4 U$2.P$8